# Altium schematic sheet power.SchDoc
size 297 x 209 mm
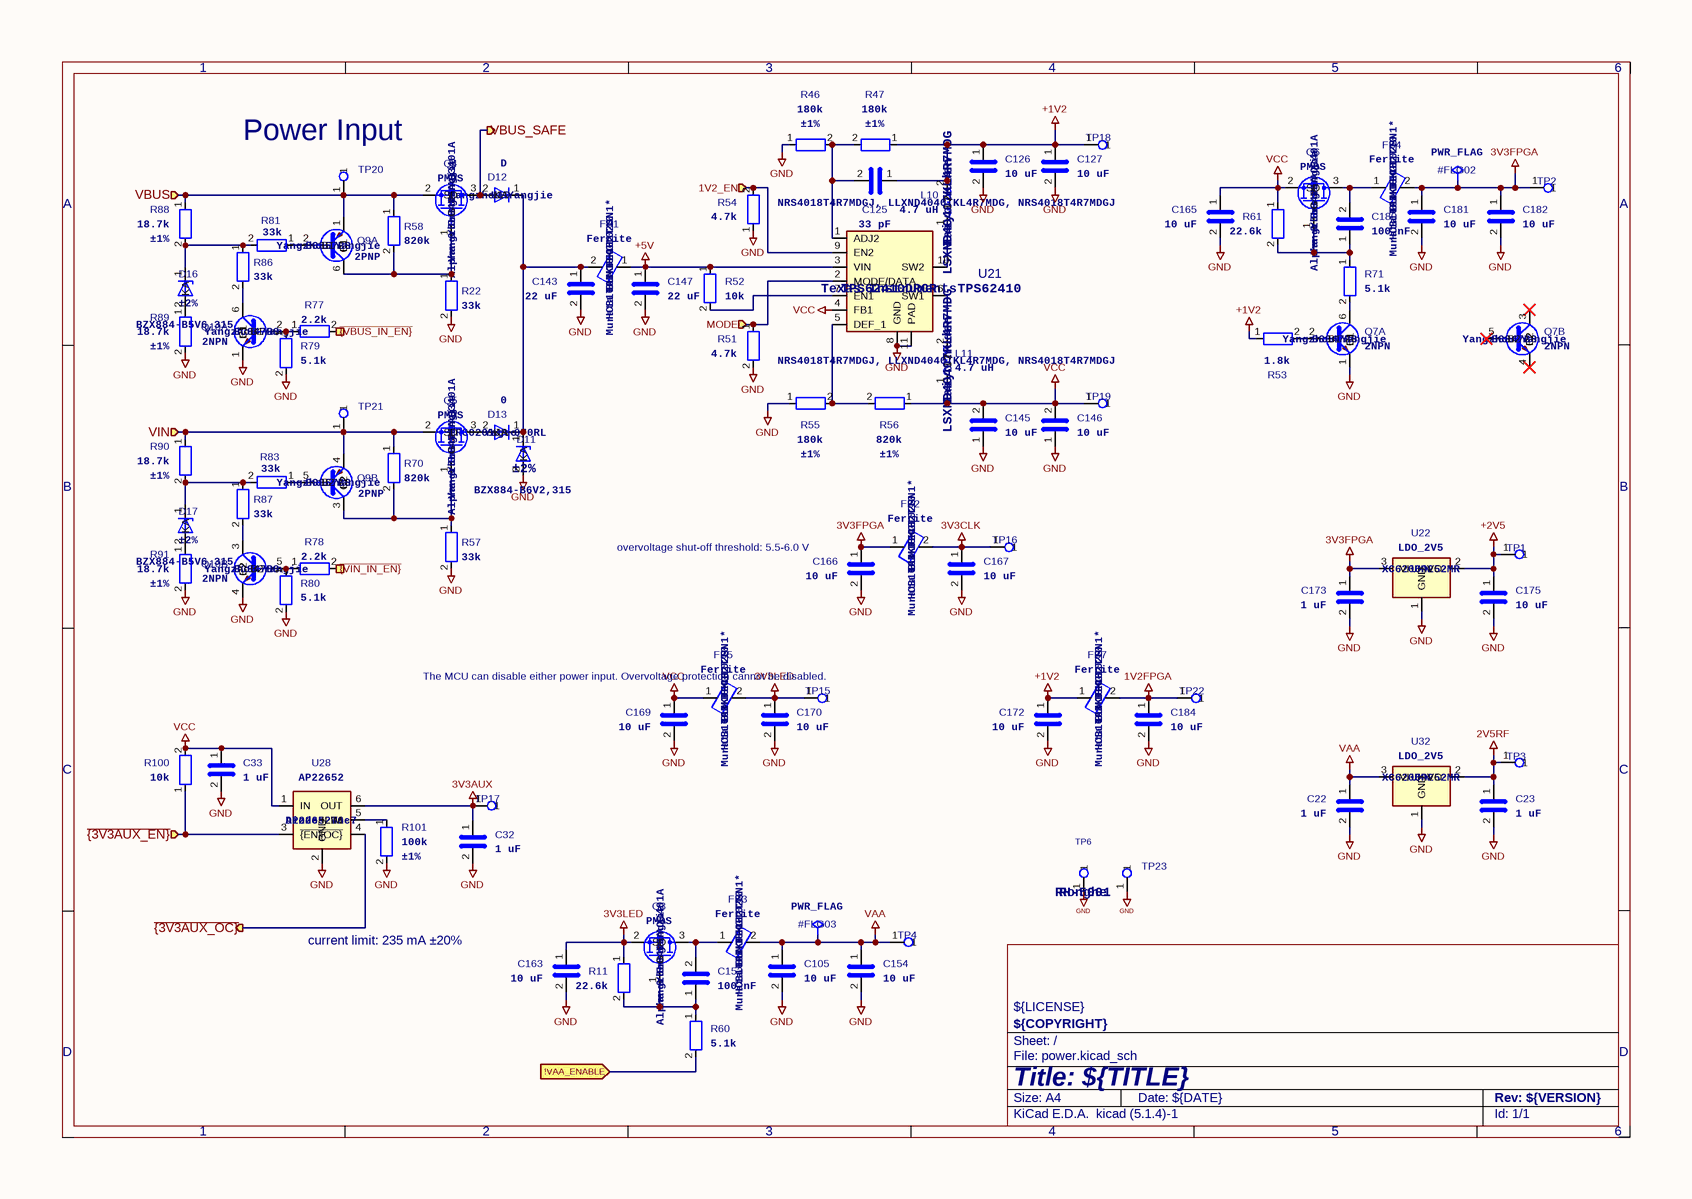
[diagram p0: power.SchDoc]

## Parts
#FLG02  PWR_FLAG  (graphical)
#FLG03  PWR_FLAG  (graphical)
C22  1 uF  [C_0402_1005Metric]
C23  1 uF  [C_0402_1005Metric]
C32  1 uF  [C_0402_1005Metric]
C33  1 uF  [C_0402_1005Metric]
C105  10 uF  [C_0805_2012Metric]
C125  33 pF  [C_0201_0603Metric]
C126  10 uF  [C_0805_2012Metric]
C127  10 uF  [C_0805_2012Metric]
C143  22 uF  [C_0805_2012Metric]
C145  10 uF  [C_0805_2012Metric]
C146  10 uF  [C_0805_2012Metric]
C147  22 uF  [C_0805_2012Metric]
C153  100 nF  [C_0402_1005Metric]
C154  10 uF  [C_0805_2012Metric]
C163  10 uF  [C_0805_2012Metric]
C165  10 uF  [C_0805_2012Metric]
C166  10 uF  [C_0805_2012Metric]
C167  10 uF  [C_0805_2012Metric]
C169  10 uF  [C_0805_2012Metric]
C170  10 uF  [C_0805_2012Metric]
C172  10 uF  [C_0805_2012Metric]
C173  1 uF  [C_0402_1005Metric]
C175  10 uF  [C_0805_2012Metric]
C180  100 nF  [C_0402_1005Metric]
C181  10 uF  [C_0805_2012Metric]
C182  10 uF  [C_0805_2012Metric]
C184  10 uF  [C_0805_2012Metric]
D11  Part Number: BZX884-B6V2,315  Tolerance: ±2%  [TSLP-2-19]  (hidden comment: 6.2 V)
D12  Manufacturer: Yangzhou Yangjie  Part Number: U1D  [D_SOD-123FL]  (hidden comment: D)
D13  Manufacturer: Yageo  Part Number: RC0201JR-070RL  [TSLP-2-19]  (hidden comment: 0)
D16  Part Number: BZX884-B5V6,315  Tolerance: ±2%  [TSLP-2-19]  (hidden comment: 5.6 V)
D17  Part Number: BZX884-B5V6,315  Tolerance: ±2%  [TSLP-2-19]  (hidden comment: 5.6 V)
FB1  Manufacturer: TAI-TECH  Part Number: HCB1608KF-102T10  Substitution: Murata BLM18KG102SN1*  [L_0603_1608Metric]  (hidden comment: Ferrite)
FB2  Manufacturer: TAI-TECH  Part Number: HCB1608KF-102T10  Substitution: Murata BLM18KG102SN1*  [L_0603_1608Metric]  (hidden comment: Ferrite)
FB3  Manufacturer: TAI-TECH  Part Number: HCB1608KF-102T10  Substitution: Murata BLM18KG102SN1*  [L_0603_1608Metric]  (hidden comment: Ferrite)
FB4  Manufacturer: TAI-TECH  Part Number: HCB1608KF-102T10  Substitution: Murata BLM18KG102SN1*  [L_0603_1608Metric]  (hidden comment: Ferrite)
FB5  Manufacturer: TAI-TECH  Part Number: HCB1608KF-102T10  Substitution: Murata BLM18KG102SN1*  [L_0603_1608Metric]  (hidden comment: Ferrite)
FB7  Manufacturer: TAI-TECH  Part Number: HCB1608KF-102T10  Substitution: Murata BLM18KG102SN1*  [L_0603_1608Metric]  (hidden comment: Ferrite)
L10  Manufacturer: Taiyo Yuden  Part Number: LSXND4040TKL4R7MDG  Substitution: NRS4018T4R7MDGJ, LLXND4040TKL4R7MDG, NRS4018T4R7MDGJ  [L_Taiyo-Yuden_NR-40xx]  (hidden comment: 4.7 uH)
L11  Manufacturer: Taiyo Yuden  Part Number: LSXND4040TKL4R7MDG  Substitution: NRS4018T4R7MDGJ, LLXND4040TKL4R7MDG, NRS4018T4R7MDGJ  [L_Taiyo-Yuden_NR-40xx]  (hidden comment: 4.7 uH)
Q3  Manufacturer: Yangzhou Yangjie  Part Number: YJL3401A  Substitution: Alpha & Omega AO3401A  [SOT-23-3]  (hidden comment: PMOS)
Q4  Manufacturer: Yangzhou Yangjie  Part Number: YJL3401A  Substitution: Alpha & Omega AO3401A  [SOT-23-3]  (hidden comment: PMOS)
Q5  Manufacturer: Yangzhou Yangjie  Part Number: YJL3401A  Substitution: Alpha & Omega AO3401A  [SOT-23-3]  (hidden comment: PMOS)
Q6  Manufacturer: Yangzhou Yangjie  Part Number: YJL3401A  Substitution: Alpha & Omega AO3401A  [SOT-23-3]  (hidden comment: PMOS)
Q7  Manufacturer: Yangzhou Yangjie  [SOT-363_SC-70-6]  (hidden comment: 2NPN)  (parts A,B of 2)
Q9  Manufacturer: Yangzhou Yangjie  Part Number: BC857BS  [SOT-363_SC-70-6]  (hidden comment: 2PNP)  (parts A,B of 2)
Q10  Manufacturer: Yangzhou Yangjie  [SOT-363_SC-70-6]  (hidden comment: 2NPN)  (parts A,B of 2)
R11  22.6k  [R_0201_0603Metric]
R22  33k  [R_0201_0603Metric]
R46  Tolerance: ±1%  [R_0402_1005Metric]  (hidden comment: 180k)
R47  Tolerance: ±1%  [R_0402_1005Metric]  (hidden comment: 180k)
R51  4.7k  [R_0201_0603Metric]
R52  10k  [R_0402_1005Metric]
R53  1.8k  [R_0402_1005Metric]
R54  4.7k  [R_0201_0603Metric]
R55  Tolerance: ±1%  [R_0402_1005Metric]  (hidden comment: 180k)
R56  Tolerance: ±1%  [R_0402_1005Metric]  (hidden comment: 820k)
R57  33k  [R_0201_0603Metric]
R58  820k  [R_0402_1005Metric]
R60  5.1k  [R_0402_1005Metric]
R61  22.6k  [R_0201_0603Metric]
R70  820k  [R_0402_1005Metric]
R71  5.1k  [R_0402_1005Metric]
R77  2.2k  [R_0201_0603Metric]
R78  2.2k  [R_0201_0603Metric]
R79  5.1k  [R_0402_1005Metric]
R80  5.1k  [R_0402_1005Metric]
R81  33k  [R_0201_0603Metric]
R83  33k  [R_0201_0603Metric]
R86  33k  [R_0201_0603Metric]
R87  33k  [R_0201_0603Metric]
R88  Tolerance: ±1%  [R_0402_1005Metric]  (hidden comment: 18.7k)
R89  Tolerance: ±1%  [R_0402_1005Metric]  (hidden comment: 18.7k)
R90  Tolerance: ±1%  [R_0402_1005Metric]  (hidden comment: 18.7k)
R91  Tolerance: ±1%  [R_0402_1005Metric]  (hidden comment: 18.7k)
R100  10k  [R_0402_1005Metric]
R101  Tolerance: ±1%  [R_0402_1005Metric]  (hidden comment: 100k)
TP1  TestPoint  [TestPoint_Pad_D1.0mm]  (value not drawn)
TP2  TestPoint  [TestPoint_Pad_D1.0mm]  (value not drawn)
TP3  TestPoint  [TestPoint_Pad_D1.0mm]  (value not drawn)
TP4  TestPoint  [TestPoint_Pad_D1.0mm]  (value not drawn)
TP6  Manufacturer: Ronghe  Part Number: RH-5001  [TestPoint_Loop_D1.80mm_Drill1.0mm_Beaded]  (hidden comment: TestPoint)
TP15  TestPoint  [TestPoint_Pad_D1.0mm]  (value not drawn)
TP16  TestPoint  [TestPoint_Pad_D1.0mm]  (value not drawn)
TP17  TestPoint  [TestPoint_Pad_D1.0mm]  (value not drawn)
TP18  TestPoint  [TestPoint_Pad_D1.0mm]  (value not drawn)
TP19  TestPoint  [TestPoint_Pad_D1.0mm]  (value not drawn)
TP20  TestPoint  [TestPoint_Pad_D1.0mm]  (value not drawn)
TP21  TestPoint  [TestPoint_Pad_D1.0mm]  (value not drawn)
TP22  TestPoint  [TestPoint_Pad_D1.0mm]  (value not drawn)
TP23  TestPoint  [TestPoint_Pad_D1.0mm]  (value not drawn)
U21  Manufacturer: Texas Instruments  Part Number: TPS62410DRCR  [Texas_S-PVSON-N10_ThermalVias]  (hidden comment: TPS62410)
U22  Manufacturer: UMW  Part Number: XC6206P252MR  [SOT-23-3]  (hidden comment: LDO_2V5)
U28  Manufacturer: Diodes Inc.  Part Number: AP22652W6-7  [TSOP-6_1.65x3.05mm_P0.95mm]  (hidden comment: AP22652)
U32  Manufacturer: UMW  Part Number: XC6206P252MR  [SOT-23-3]  (hidden comment: LDO_2V5)

## Ports
1V2_EN (in), !VAA_ENABLE (in), MODE (in), VBUS (in), VBUS_SAFE (out), VIN (in), ~{{3V3AUX_EN}} (in), ~{{3V3AUX_OC}} (out), ~{{VBUS_IN_EN}} (in), ~{{VIN_IN_EN}} (in)

## Nets
1V2FPGA: C184.1 FB7.2 TP22.1
2V5RF: C23.1 TP3.1 U32.2(VO)
3V3AUX: C32.1 TP17.1 U28.6(OUT)
3V3CLK: C167.1 FB2.2 TP16.1
3V3FPGA: #FLG02.1 C166.1 C173.1 C181.1 C182.1 FB2.1 FB4.2 TP2.1 U22.3(VI)
3V3LED: C163.1 C170.1 FB5.2 Q3.2(S) R11.1 TP15.1
+1V2: C125.1 C126.1 C127.1 C172.1 FB7.1 L10.2 R47.1 R53.1 TP18.1
+2V5: C175.1 TP1.1 U22.2(VO)
+5V: C147.1 FB1.1 R52.1 U21.3(VIN)
GND: C22.2 C23.2 C32.2 C33.2 C105.2 C126.2 C127.2 C143.2 C145.1 C146.1 C147.2 C154.2 C163.2 C165.2 C166.2 C167.2 C169.2 C170.2 C172.2 C173.2 C175.2 C181.2 C182.2 C184.2 D11.2(A) Q7.1(E1) Q10.1(E1) Q10.4(E2) R22.2 R46.1 R51.2 R54.1 R55.1 R57.2 R79.2 R80.2 R89.2 R91.2 R101.2 TP6.1 TP23.1 U21.8(GND) U21.11(PAD) U22.1(GND) U28.2(GND) U32.1(GND)
VAA: #FLG03.1 C22.1 C105.1 C154.1 FB3.2 TP4.1 U32.3(VI)
VCC: C33.1 C145.2 C146.2 C165.1 C169.1 FB5.1 L11.1 Q6.2(S) R56.1 R61.1 R100.2 TP19.1 U21.4(FB1) U28.1(IN)
1V2_EN: R54.2 U21.9(EN2) ; port 1V2_EN
!VAA_ENABLE: R60.2 ; port !VAA_ENABLE
MODE: R51.1 U21.2(MODE/DATA) ; port MODE
VBUS: Q4.2(S) Q9.1(E1) R58.1 R88.1 TP20.1 ; port VBUS
VBUS_SAFE: D12.2(A) Q4.3(D) ; port VBUS_SAFE
VIN: Q5.2(S) Q9.4(E2) R70.1 R90.1 TP21.1 ; port VIN
~{{3V3AUX_EN}}: R100.1 U28.3(~{{EN}}) ; port ~{{3V3AUX_EN}}
~{{3V3AUX_OC}}: U28.4(~{{OC}}) ; port ~{{3V3AUX_OC}}
~{{VBUS_IN_EN}}: R77.2 ; port ~{{VBUS_IN_EN}}
~{{VIN_IN_EN}}: R78.2 ; port ~{{VIN_IN_EN}}
NetC125_2: C125.2 R46.2 R47.2 U21.1(ADJ2)
NetC143_1: C143.1 D11.1(K) D12.1(K) D13.1(K) FB1.2
NetC153_1: C153.1 Q3.1(G) R11.2 R60.1
NetC153_2: C153.2 FB3.1 Q3.3(D)
NetC180_1: C180.1 Q6.1(G) R61.2 R71.1
NetC180_2: C180.2 FB4.1 Q6.3(D)
NetD13_2: D13.2(A) Q5.3(D)
NetD16_1: D16.1(K) R81.2 R86.1 R88.2
NetD16_2: D16.2(A) R89.1
NetD17_1: D17.1(K) R83.2 R87.1 R90.2
NetD17_2: D17.2(A) R91.1
NetL10_1: L10.1 U21.10(SW2)
NetL11_2: L11.2 U21.6(SW1)
NetQ4_1: Q4.1(G) Q9.6(C1) R22.1 R58.2
NetQ5_1: Q5.1(G) Q9.3(C2) R57.1 R70.2
NetQ7_2: Q7.2(B1) R53.2
NetQ7_6: Q7.6(C1) R71.2
NetQ9_2: Q9.2(B1) R81.1
NetQ9_5: Q9.5(B2) R83.1
NetQ10_2: Q10.2(B1) R77.1 R79.1
NetQ10_3: Q10.3(C2) R87.2
NetQ10_5: Q10.5(B2) R78.1 R80.1
NetQ10_6: Q10.6(C1) R86.2
NetR52_2: R52.2 U21.7(EN1)
NetR55_2: R55.2 R56.2 U21.5(DEF_1)
NetR101_1: R101.1 U28.5(ILIM)

Not connected (* = marked no-connect by the designer): Q7 3(C2)* 4(E2)* 5(B2)*

## Notes on the sheet
- (near TP20) Power Input
- (near C166) overvoltage shut-off
  threshold: 5.5-6.0 V
- The MCU can disable either power input.
  Overvoltage protection cannot be disabled.
- current limit: 235 mA ±20%
- 1
- 2
- 3
- 4
- 5
- 6
- A
- B
- C
- ${LICENSE}
- D
- Title: ${TITLE}
- File: power.kicad_sch
- Sheet: /
- ${COPYRIGHT}
- KiCad E.D.A.  kicad (5.1.4)-1
- Size: A4
- Date: ${DATE}
- Rev: ${VERSION}
- Id: 1/1

## Library data of the parts
C22 C23 C173 = C: Part Number: CL05A105KA5NQNC; Manufacturer: Samsung; Substitution: Murata GRM155R61E105KA12D; Value: 1 uF; Footprint: Capacitor_SMD:C_0402_1005Metric
C32 C33 = C: Manufacturer: Samsung; Part Number: CL05A105KA5NQNC; Substitution: Murata GRM155R61E105KA12D; Value: 1 uF; Footprint: Capacitor_SMD:C_0402_1005Metric
C105 C126 C127 C145 C146 C154 C163 C165-C167 C169 C170 C172 C175 C181 C182 C184 = C: Manufacturer: Samsung; Part Number: CL21A106KOQNNNE; Substitution: Murata GRM21BR61A106KE19L; Value: 10 uF; Footprint: Capacitor_SMD:C_0805_2012Metric
C125 = C: Manufacturer: Murata; Part Number: GRM0335C1H330JA01D; Substitution: GRM0335C1H330*, GRM0335C1E330*; Value: 33 pF; Footprint: Capacitor_SMD:C_0201_0603Metric
C143 C147 = C: Manufacturer: Samsung; Part Number: CL21A226MAYNNNE; Substitution: Murata GRM21BR61A106KE19L; Value: 22 uF; Footprint: Capacitor_SMD:C_0805_2012Metric
C153 C180 = C: Manufacturer: Samsung; Part Number: CL05A104KA5NNNC; Substitution: Murata GRM155R61A104KA01D; Value: 100 nF; Footprint: Capacitor_SMD:C_0402_1005Metric
D11 D16 D17 = D_Zener: Manufacturer: Nexperia; Footprint: praline:TSLP-2-19
  D11: Value: 6.2 V
  D16 D17: Value: 5.6 V
D13 = D: Value: 0; Footprint: praline:TSLP-2-19
FB1-FB5 FB7 = FerriteBead: Value: Ferrite; Footprint: Inductor_SMD:L_0603_1608Metric
L10 L11 = L: Value: 4.7 uH; Footprint: Inductor_SMD:L_Taiyo-Yuden_NR-40xx
Q3-Q6 = Q_PMOS_GSD: Value: PMOS; Footprint: Package_TO_SOT_SMD:SOT-23-3
Q7 Q10 = BC847BS: Part Number: BC847BS; Value: 2NPN; Footprint: Package_TO_SOT_SMD:SOT-363_SC-70-6
Q9 = Q_Dual_PNP_PNP_E1B1C2E2B2C1: Value: 2PNP; Footprint: Package_TO_SOT_SMD:SOT-363_SC-70-6
R11 R61 = R: Manufacturer: Yageo; Part Number: RC0201FR-0722K6L; Substitution: any equivalent; Value: 22.6k; Footprint: Resistor_SMD:R_0201_0603Metric
R22 R57 R86 R87 = R: Manufacturer: Yageo; Part Number: RC0201JR-0733KL; Substitution: any equivalent; Value: 33k; Footprint: Resistor_SMD:R_0201_0603Metric
R46 R47 R55 = R: Manufacturer: Yageo; Part Number: RC0402FR-07180KL; Substitution: any equivalent; Value: 180k; Footprint: Resistor_SMD:R_0402_1005Metric
R51 R54 = R: Manufacturer: Yageo; Part Number: RC0201FR-074K7L; Substitution: any equivalent; Value: 4.7k; Footprint: Resistor_SMD:R_0201_0603Metric
R52 R100 = R: Manufacturer: Yageo; Part Number: RC0402JR-0710KL; Substitution: any equivalent; Value: 10k; Footprint: Resistor_SMD:R_0402_1005Metric
R53 = R: Manufacturer: Yageo; Part Number: RC0402JR-071K8L; Substitution: any equivalent; Value: 1.8k; Footprint: Resistor_SMD:R_0402_1005Metric
R56 = R: Manufacturer: Yageo; Part Number: RC0402FR-07820KL; Substitution: any equivalent; Value: 820k; Footprint: Resistor_SMD:R_0402_1005Metric
R58 R70 = R: Part Number: RC0402FR-07820KL; Manufacturer: Yageo; Substitution: any equivalent; Value: 820k; Footprint: Resistor_SMD:R_0402_1005Metric
R60 R71 R79 R80 = R: Part Number: RC0402JR-075K1L; Manufacturer: Yageo; Substitution: any equivalent; Value: 5.1k; Footprint: Resistor_SMD:R_0402_1005Metric
R77 R78 = R: Part Number: RC0201JR-072K2L; Manufacturer: Yageo; Substitution: any equivalent; Value: 2.2k; Footprint: Resistor_SMD:R_0201_0603Metric
R81 R83 = R: Part Number: RC0201JR-0733KL; Manufacturer: Yageo; Substitution: any equivalent; Value: 33k; Footprint: Resistor_SMD:R_0201_0603Metric
R88-R91 = R: Manufacturer: Yageo; Part Number: RC0402FR-0718K7L; Substitution: any equivalent; Value: 18.7k; Footprint: Resistor_SMD:R_0402_1005Metric
R101 = R: Manufacturer: Yageo; Part Number: RC0402FR-07100KL; Substitution: any equivalent; Value: 100k; Footprint: Resistor_SMD:R_0402_1005Metric
U22 U32 = XC6206PxxxMR: Value: LDO_2V5; Footprint: Package_TO_SOT_SMD:SOT-23-3
U28 = BD2243G: Value: AP22652; Footprint: Package_SO:TSOP-6_1.65x3.05mm_P0.95mm
#FLG02 #FLG03 = PWR_FLAG: Value: PWR_FLAG
D12 = D: Value: D; Footprint: praline:D_SOD-123FL
TP1-TP4 TP6 TP15-TP23 = TestPoint: Value: TestPoint
  TP1-TP4 TP15-TP23: Footprint: TestPoint:TestPoint_Pad_D1.0mm
  TP6: Footprint: TestPoint:TestPoint_Loop_D1.80mm_Drill1.0mm_Beaded
U21 = TPS62410: Value: TPS62410; Footprint: praline:Texas_S-PVSON-N10_ThermalVias